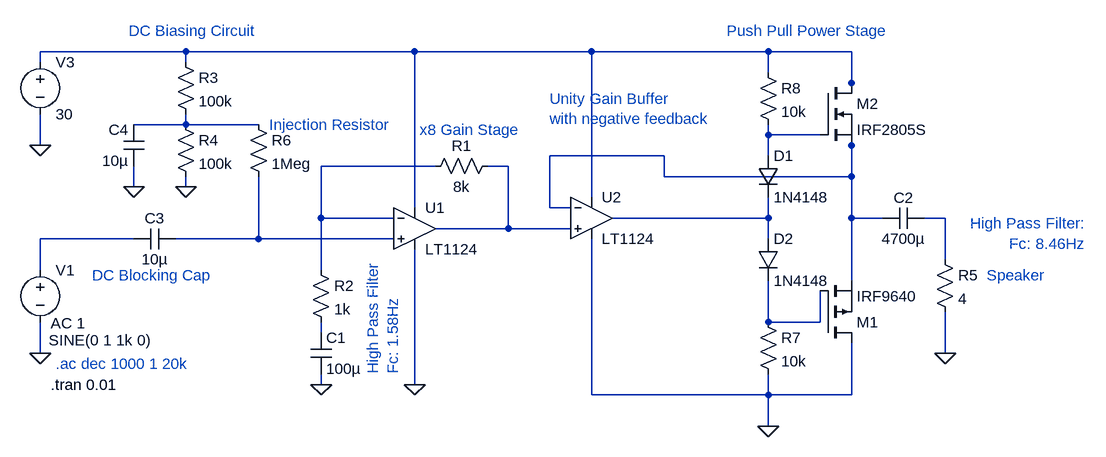
[diagram p0: schematic Audio_Amplifier_DC_Bias.asc]
Audio_Amplifier_DC_Bias.asc, the LTspice schematic file:
Version 4
SHEET 1 1496 680
WIRE -320 -256 -544 -256
WIRE 32 -256 -320 -256
WIRE 304 -256 32 -256
WIRE 576 -256 304 -256
WIRE 704 -256 576 -256
WIRE -544 -240 -544 -256
WIRE -320 -240 -320 -256
WIRE 576 -224 576 -256
WIRE 704 -208 704 -256
WIRE 704 -192 704 -208
WIRE -320 -144 -320 -160
WIRE -320 -144 -400 -144
WIRE -208 -144 -320 -144
WIRE 576 -128 576 -144
WIRE 656 -128 576 -128
WIRE -544 -112 -544 -160
WIRE 704 -112 704 -128
WIRE 416 -96 240 -96
WIRE 576 -96 576 -128
WIRE 64 -80 -112 -80
WIRE 176 -80 144 -80
WIRE 416 -64 416 -96
WIRE 704 -64 704 -112
WIRE 704 -64 416 -64
WIRE -400 -48 -400 -80
WIRE -320 -48 -320 -64
WIRE 304 -32 304 -256
WIRE 32 -16 32 -256
WIRE 240 -16 240 -96
WIRE 272 -16 240 -16
WIRE -112 0 -112 -80
WIRE 0 0 -112 0
WIRE 576 0 576 -32
WIRE 576 0 336 0
WIRE 704 0 704 -64
WIRE 752 0 704 0
WIRE 848 0 816 0
WIRE 176 16 176 -80
WIRE 176 16 64 16
WIRE 272 16 176 16
WIRE -400 32 -544 32
WIRE -208 32 -208 -64
WIRE -208 32 -336 32
WIRE 0 32 -208 32
WIRE 576 32 576 0
WIRE 848 64 848 0
WIRE -544 80 -544 32
WIRE -112 80 -112 0
WIRE 704 96 704 0
WIRE 576 160 576 96
WIRE 656 160 656 112
WIRE 656 160 576 160
WIRE -112 176 -112 160
WIRE -544 208 -544 160
WIRE 848 208 848 144
WIRE -112 256 -112 240
WIRE 32 256 32 48
WIRE 304 272 304 32
WIRE 576 272 576 240
WIRE 576 272 304 272
WIRE 704 272 704 192
WIRE 704 272 576 272
WIRE 576 320 576 272
FLAG -544 208 0
FLAG -544 -112 0
FLAG -112 256 0
FLAG 32 256 0
FLAG 848 208 0
FLAG 576 320 0
FLAG -320 -48 0
FLAG -400 -48 0
SYMBOL res 160 -96 R90
WINDOW 0 0 56 VBottom 2
WINDOW 3 32 56 VTop 2
SYMATTR InstName R1
SYMATTR Value 8k
SYMBOL voltage -544 64 R0
WINDOW 3 13 124 Left 2
WINDOW 123 16 98 Left 2
WINDOW 39 0 0 Left 0
SYMATTR Value SINE(0 1 1k 0)
SYMATTR Value2 AC 1
SYMATTR InstName V1
SYMBOL OpAmps\\LT1124 32 -48 R0
SYMATTR InstName U1
SYMBOL voltage -544 -256 R0
WINDOW 123 0 0 Left 0
WINDOW 39 0 0 Left 0
SYMATTR InstName V3
SYMATTR Value 30
SYMBOL res -128 64 R0
SYMATTR InstName R2
SYMATTR Value 1k
SYMBOL cap -128 176 R0
SYMATTR InstName C1
SYMATTR Value 100µ
SYMBOL cap -336 16 R90
WINDOW 0 0 32 VBottom 2
WINDOW 3 32 32 VTop 2
SYMATTR InstName C3
SYMATTR Value 10µ
SYMBOL res 832 48 R0
SYMATTR InstName R5
SYMATTR Value 4
SYMBOL res 560 144 R0
SYMATTR InstName R7
SYMATTR Value 10k
SYMBOL res 560 -240 R0
SYMATTR InstName R8
SYMATTR Value 10k
SYMBOL OpAmps\\LT1124 304 -64 R0
SYMATTR InstName U2
SYMBOL diode 560 -96 R0
SYMATTR InstName D1
SYMATTR Value 1N4148
SYMBOL cap 816 -16 R90
WINDOW 0 0 32 VBottom 2
WINDOW 3 32 32 VTop 2
SYMATTR InstName C2
SYMATTR Value 4700µ
SYMBOL pmos 656 192 M180
SYMATTR InstName M1
SYMATTR Value IRF9640
SYMBOL diode 560 32 R0
SYMATTR InstName D2
SYMATTR Value 1N4148
SYMBOL nmos 656 -208 R0
SYMATTR InstName M2
SYMATTR Value IRF2805S
SYMBOL res -336 -256 R0
SYMATTR InstName R3
SYMATTR Value 100k
SYMBOL res -336 -160 R0
SYMATTR InstName R4
SYMATTR Value 100k
SYMBOL res -224 -160 R0
SYMATTR InstName R6
SYMATTR Value 1Meg
SYMBOL cap -384 -144 M0
SYMATTR InstName C4
SYMATTR Value 10µ
TEXT -528 256 Left 2 !.tran 0.01
TEXT -520 224 Left 2 ;.ac dec 1000 1 20k
TEXT -464 88 Left 2 ;DC Blocking Cap
TEXT -32 240 VLeft 2 ;High Pass Filter\nFc: 1.58Hz
TEXT 40 -136 Left 2 ;x8 Gain Stage
TEXT 1064 8 Right 2 ;High Pass Filter:\nFc: 8.46Hz
TEXT 912 88 Left 2 ;Speaker
TEXT 512 -288 Left 2 ;Push Pull Power Stage
TEXT 240 -184 Left 2 ;Unity Gain Buffer\nwith negative feedback
TEXT -192 -144 Left 2 ;Injection Resistor
TEXT -408 -288 Left 2 ;DC Biasing Circuit

The netlist it stands for:
* Audio_Amplifier_DC_Bias.asc
R1 N006 N005 8k
V1 N009 0 SINE(0 1 1k 0) AC 1
XU1 N010 N005 N001 0 N006 LT1124  ; pins In+ In- V+ V- OUT
V3 N001 0 30
R2 N005 N012 1k
C1 N012 0 100µ
C3 N010 N009 10µ
R5 N008 0 4
R7 N011 0 10k
R8 N001 N003 10k
XU2 N006 N004 N001 0 N007 LT1124  ; pins In+ In- V+ V- OUT
D1 N003 N007 1N4148
C2 N008 N004 4700µ
M1 0 N011 N004 N004 IRF9640
D2 N007 N011 1N4148
M2 N001 N003 N004 N004 IRF2805S
R3 N001 N002 100k
R4 N002 0 100k
R6 N002 N010 1Meg
C4 N002 0 10µ
.model D D
.lib standard.dio
.model NMOS NMOS
.model PMOS PMOS
.lib standard.mos
.tran 0.01
* .ac dec 1000 1 20k
* DC Blocking Cap
* High Pass Filter
* Fc: 1.58Hz
* x8 Gain Stage
* High Pass Filter:
* Fc: 8.46Hz
* Speaker
* Push Pull Power Stage
* Unity Gain Buffer
* with negative feedback
* Injection Resistor
* DC Biasing Circuit
.lib LTC.lib
.backanno
.end